# EAGLE design QRP SSB 20m (EAGLE 9.1.2)
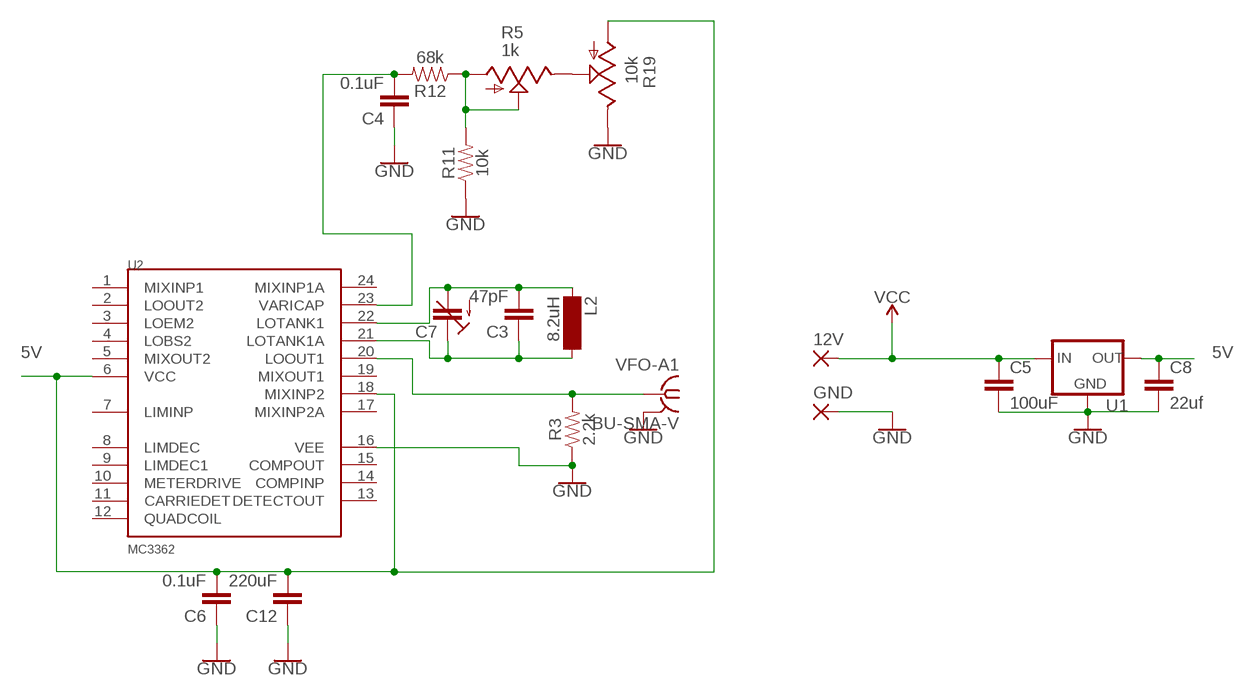
[diagram p0: schematic, sheet 1]

## Parts
12V  3,17/1,1  [3,17/1,1]
C3  47pF  C5/3.5  [C5B3.5]
C4  0.1uF  C5/3.5  [C5B3.5]
C5  100uF  C5/3.5  [C5B3.5]
C6  0.1uF  C5/3.5  [C5B3.5]
C7  C-TRIMMTZ03  [CTRIMTZ03]
C8  22uf  C5/3.5  [C5B3.5]
C12  220uF  C5/3.5  [C5B3.5]
GND  3,17/1,1  [3,17/1,1]
L2  8.2uH  BS75  [BS75]
R3  2.2k  1KOHM-HORIZ-1/4W-1%  [AXIAL-0.3]
R5  1k  TRIM_US-B25V  [B25V]
R11  10k  1KOHM-HORIZ-1/4W-1%  [AXIAL-0.3]
R12  68k  1KOHM-HORIZ-1/4W-1%  [AXIAL-0.3]
R19  10k  TRIM_US-B25V  [B25V]
U1  V_REG_78XXTO-92_UNTESTED  [TO-92]
U2  MC3362  [DIP24]
VFO-A1  BU-SMA-V  [BU-SMA-V]

## Nets
5V: C6.2 C8.1 C12.2 R19.A U1.1(OUT) U2.6(VCC) U2.18(MIXINP2)
GND: C4.1 C5.2 C6.1 C8.2 C12.1 GND.1(P) R3.P$1 R11.P$1 R19.E U1.2(GND) U2.16(VEE) VFO-A1.2 VFO-A1.3 VFO-A1.4 VFO-A1.5
N$4: C3.1 C7.1(E) L2.2 U2.21(LOTANK1A)
N$7: C3.2 C7.2(A) L2.1 U2.22(LOTANK1)
N$9: R3.P$2 U2.20(LOOUT1) VFO-A1.1
N$19: R5.E R19.S
N$20: R5.A R5.S R11.P$2 R12.P$1
N$21: C4.2 R12.P$2 U2.23(VARICAP)
VCC: 12V.1(P) C5.1 U1.3(IN)
Unconnected: U2.1(MIXINP1) U2.2(LOOUT2) U2.3(LOEM2) U2.4(LOBS2) U2.5(MIXOUT2) U2.7(LIMINP) U2.8(LIMDEC) U2.9(LIMDEC1) U2.10(METERDRIVE) U2.11(CARRIEDET) U2.12(QUADCOIL) U2.13(DETECTOUT) U2.14(COMPINP) U2.15(COMPOUT) U2.17(MIXINP2A) U2.19(MIXOUT1) U2.24(MIXINP1A)

## Library data of the parts
12V GND = wirepad:3,17/1,1: THROUGH-HOLE PAD
C3-C6 C8 C12 = capacitor-wima:C: CAPACITOR naming: grid - package width
C7 = resistor:C-TRIMM: Trimm capacitor
L2 = inductor-neosid:BS: INDUCTOR nominal inductance, magnetically screened; OC_FARNELL: unknown; OC_NEWARK: unknown
R3 R11 R12 = SparkFun-Resistors:1KOHM: 1kΩ resistor A resistor is a passive two-terminal electrical component that implements electrical resistance as a circuit element. Resistors act to reduce current flow, and, at the same time, act to lower voltage levels within circuits. - Wikipedia; PROD_ID: RES-12182; VALUE: 1k
R5 R19 = pot:TRIM_US-: POTENTIOMETER
U1 = SparkFun-IC-Power:V_REG_78XX: Voltage Regulator Standard 78xx regulator. IGO (Input Ground Output). Spark Fun Electronics SKU : COM-00107
U2 = SparkFun-IC-Microcontroller:MC3362: MC3362 Low Power Narrowband FM Receiver Datasheet <http://pdf.datasheetcatalog.com/datasheet/motorola/MC3362DW.pdf>
VFO-A1 = con-coax:BU-SMA-V: FEMALE SMA CONNECTOR Radiall distributor RS 112-3794; OC_FARNELL: unknown; OC_NEWARK: unknown

## Net classes
0 default: width 0.762 mm, drill 0.762 mm, clearance 0.508 mm

## Board
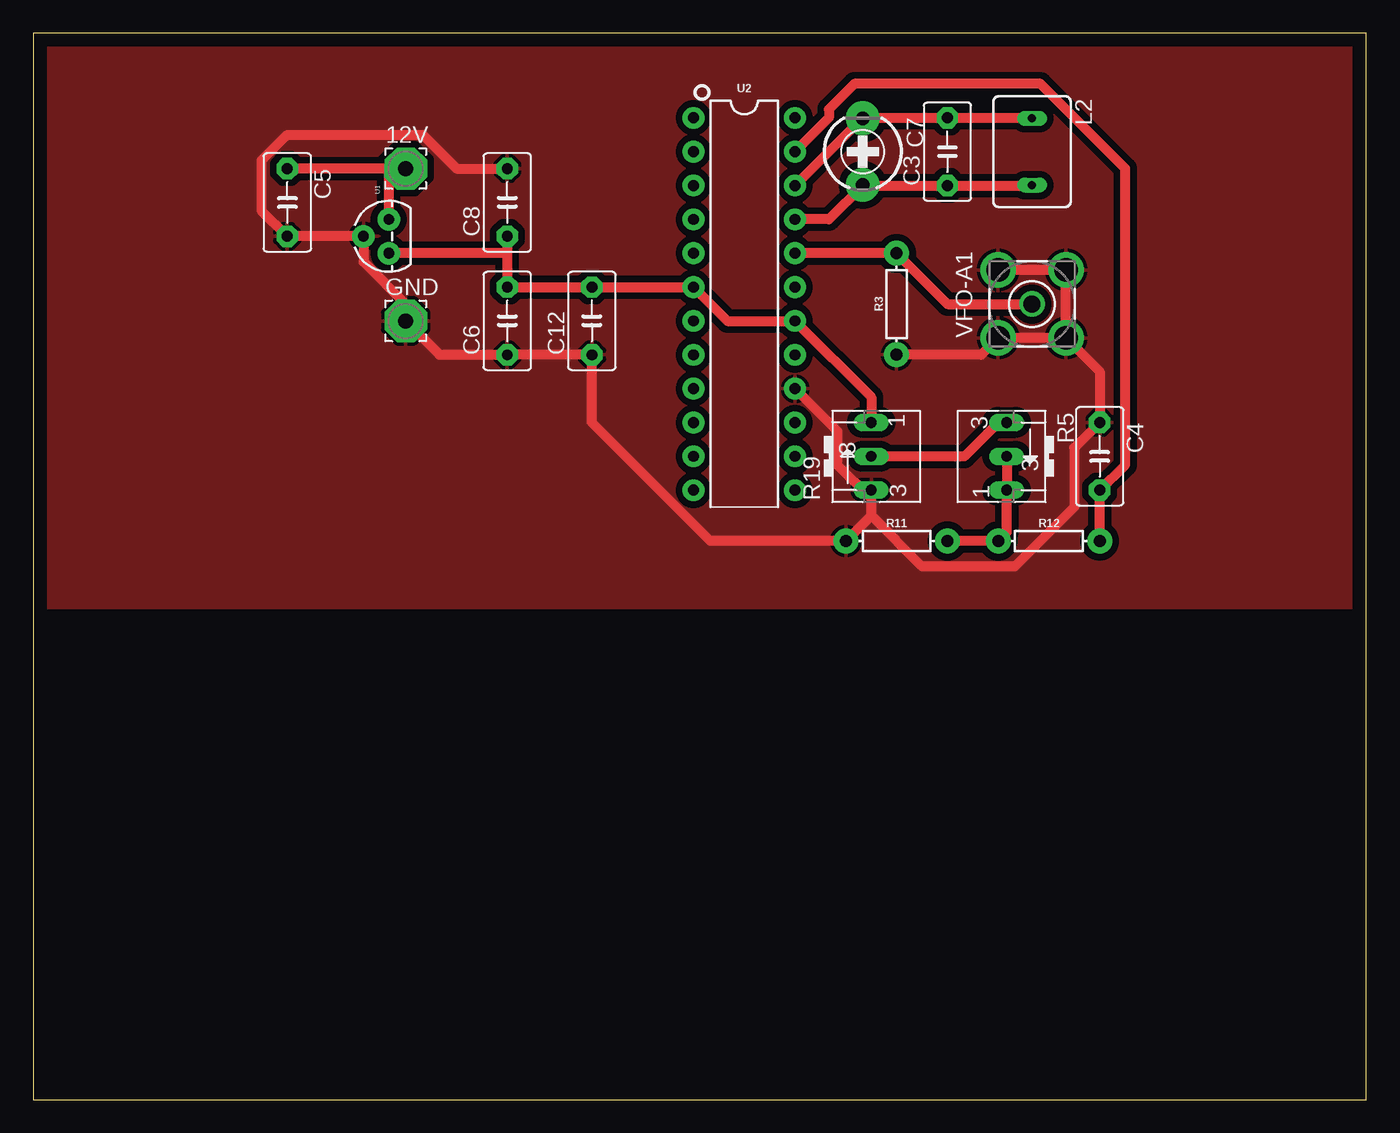
[diagram p1: board, top side]

Size 100 x 80 mm. Coordinates in mm from the lower left corner, seen from the top.
Outline: 0,0 100,0 100,80 0,80 0,0
Copper layers (1*16): Top 0.035mm / dielectric 1.5mm / Bottom 0.035mm
Design rules "default": minimum track width 6mil, minimum drill 0.35mm, track to track 6mil, track to pad 6mil, pad to pad 6mil, via to via 6mil, smd to smd 6mil, copper to edge 40mil, drill to drill 6mil, minimum pad ring 10mil, minimum via ring 8mil, stop-mask expansion 4mil, vias tented up to drill 0mil, thermal gap 10mil

### Footprints (pad centres in the part's own frame; a part is rotated, then mirrored left to right if it is on the bottom)
3,17/1,1 = drill 1.118 pad 3.175 octagon: 1 0,0
C5B3.5 = drill 0.813 pad 1.6 octagon: 1 -2.54,0; 2 2.54,0
CTRIMTZ03 = drill 1 pad 2.54: 1 0,2.5; 2 0,-2.5
BS75 = drill 0.6 long: 1 -2.5,0; 2 2.5,0
AXIAL-0.3 = drill 0.9 pad 1.88: P$1 -3.81,0; P$2 3.81,0
B25V = drill 0.813 long: A 2.54,0.635; E -2.54,0.635; S 0,0.635
TO-92 = drill 0.813 pad 1.676: 1 -1.27,0; 2 0,1.905; 3 1.27,0
DIP24 = drill 0.813 pad 1.626: 1 -16.51,-3.81; 2 -13.97,-3.81; 3 -11.43,-3.81; 4 -8.89,-3.81; 5 -6.35,-3.81; 6 -3.81,-3.81; 7 -1.27,-3.81; 8 1.27,-3.81; 9 3.81,-3.81; 10 6.35,-3.81; 11 8.89,-3.81; 12 11.43,-3.81; 13 11.43,3.81; 14 8.89,3.81; 15 6.35,3.81; 16 3.81,3.81; 17 1.27,3.81; 18 -1.27,3.81; 19 -3.81,3.81; 20 -6.35,3.81; 21 -8.89,3.81; 22 -11.43,3.81; 23 -13.97,3.81; 24 -16.51,3.81
BU-SMA-V = drill 1.27: 1 0,0 | drill 1.778: 2 -2.55,2.55; 3 2.55,2.55; 4 2.55,-2.55; 5 -2.55,-2.55

### Placement (x,y rotation side)
12V  27.94,69.85 0 top
C3  68.58,71.12 90 top
C4  80.01,48.26 270 top
C5  19.05,67.31 270 top
C6  35.56,58.42 90 top
C7  62.23,71.12 180 top
C8  35.56,67.31 90 top
C12  41.91,58.42 90 top
GND  27.94,58.42 0 top
L2  74.93,71.12 270 top
R3  64.77,59.69 90 top
R5  72.39,48.26 270 top
R11  64.77,41.91 0 top
R12  76.2,41.91 0 top
R19  63.5,48.26 90 top
U1  26.67,64.77 90 top
U2  53.34,57.15 270 top
VFO-A1  74.93,59.69 90 top

### Tracks (layer width: path | path; a pad name or v marks a point on that pad's centre or on a via)
5V
  Top 0.762: R19.A 62.87,52.7 U2.18 52.07,58.42 U2.6 C12.2 C6.2 35.56,63.5 | C8.1 35.56,63.5 | 35.56,63.5 U1.1
GND
  Top 0.762: C8.2 31.75,69.85 29.21,72.39 19.05,72.39 17.14,70.48 17.14,66.67 C5.2 U1.2 24.77,62.87 27.94,59.69 GND.1 30.48,55.88 C6.1 C12.1 41.91,50.8 50.8,41.91 R11.P$1 62.87,43.81 | 62.87,43.81 62.87,45.09 | 62.87,45.09 R19.E 62.87,45.09 | U2.16 60.33,50.16 60.33,47.62 62.87,45.09 | R3.P$1 71.12,55.88 71.75,56.52 VFO-A1.2 VFO-A1.5 | VFO-A1.4 VFO-A1.3 | VFO-A1.4 | VFO-A1.5 78.11,56.52 80.01,54.61 C4.1 78.11,48.9 78.11,44.45 73.66,40.01 66.67,40.01 62.87,43.81 | VFO-A1.5 VFO-A1.4 | VFO-A1.5 | VFO-A1.5
  pour Top: 0,80.01 100.33,80.01 100.33,36.83 0,36.83
N$4
  Top 0.762: L2.2 74.93,68.58 C3.1 62.23,68.58 | U2.21 59.69,66.04 62.23,68.58 | 62.23,68.58 C7.1 62.23,68.58
N$7
  Top 0.762: L2.1 74.93,73.66 C3.2 62.23,73.66 | 62.23,73.66 U2.22 | 62.23,73.66 C7.2 62.23,73.66
N$9
  Top 0.762: U2.20 R3.P$2 68.58,59.69 VFO-A1.1
N$19
  Top 0.762: R19.S 69.85,48.26 72.39,50.8 R5.E
N$20
  Top 0.762: R5.S R5.A 73.03,42.55 R12.P$1 R11.P$2
N$21
  Top 0.762: R12.P$2 C4.2 81.92,47.62 81.92,69.85 75.56,76.2 61.59,76.2 59.69,74.3 59.69,73.66 U2.23
VCC
  Top 0.762: 26.67,69.85 12V.1 26.67,69.85 | 26.67,69.85 C5.1 | 26.67,69.85 U1.3